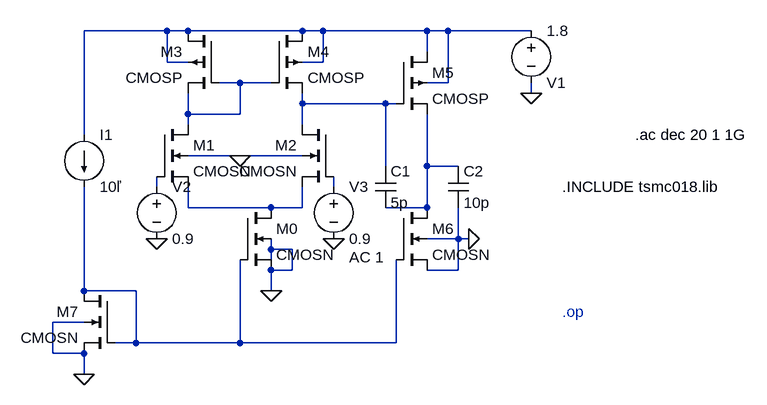
[diagram p0: schematic ac_response_design2.asc]
ac_response_design2.asc, the LTspice schematic file:
Version 4.1
SHEET 1 932 680
WIRE 32 16 -96 16
WIRE 64 16 32 16
WIRE 240 16 64 16
WIRE 272 16 240 16
WIRE 432 16 272 16
WIRE 464 16 432 16
WIRE 592 16 464 16
WIRE 432 48 432 16
WIRE 32 64 32 16
WIRE 64 64 32 64
WIRE 272 64 272 16
WIRE 272 64 240 64
WIRE 144 96 112 96
WIRE 192 96 144 96
WIRE 464 96 464 16
WIRE 464 96 432 96
WIRE 592 112 592 96
WIRE 240 128 240 112
WIRE 368 128 240 128
WIRE 384 128 368 128
WIRE 64 144 64 112
WIRE 144 144 144 96
WIRE 144 144 64 144
WIRE 64 160 64 144
WIRE 240 160 240 128
WIRE -96 176 -96 16
WIRE 144 208 64 208
WIRE 240 208 144 208
WIRE 368 224 368 128
WIRE 432 224 432 144
WIRE 480 224 432 224
WIRE 16 256 16 240
WIRE 288 256 288 240
WIRE 64 288 64 256
WIRE 192 288 64 288
WIRE 240 288 240 256
WIRE 240 288 192 288
WIRE 432 288 432 224
WIRE 432 288 368 288
WIRE 480 336 480 288
WIRE 480 336 432 336
WIRE 496 336 480 336
WIRE 192 352 192 336
WIRE 224 352 192 352
WIRE 192 368 192 352
WIRE 224 384 224 352
WIRE 224 384 192 384
WIRE 480 384 480 336
WIRE 480 384 432 384
WIRE -96 416 -96 256
WIRE -16 416 -96 416
WIRE 192 416 192 384
WIRE -96 464 -144 464
WIRE -16 496 -16 416
WIRE -16 496 -48 496
WIRE 144 496 144 368
WIRE 144 496 -16 496
WIRE 384 496 384 368
WIRE 384 496 144 496
WIRE -144 512 -144 464
WIRE -96 512 -144 512
WIRE -96 544 -96 512
FLAG 192 416 0
FLAG 144 208 0
FLAG -96 544 0
FLAG 592 112 0
FLAG 16 336 0
FLAG 288 336 0
FLAG 496 336 0
SYMBOL cmosn 16 160 R0
SYMATTR InstName M1
SYMATTR Value2 l=0.5u w=6u
SYMBOL cmosn 288 160 M0
SYMATTR InstName M2
SYMATTR Value2 l=0.5u w=6u
SYMBOL cmosn 144 288 R0
SYMATTR InstName M0
SYMATTR Value2 l=0.5u w=13u
SYMBOL cmosn 384 288 R0
SYMATTR InstName M6
SYMATTR Value2 l=0.5u w=59u
SYMBOL cmosp 112 16 M0
SYMATTR InstName M3
SYMATTR Value2 l=0.5u w=13u
SYMBOL cmosp 192 16 R0
SYMATTR InstName M4
SYMATTR Value2 l=0.5u w=13u
SYMBOL cmosp 384 48 R0
SYMATTR InstName M5
SYMATTR Value2 l=0.5u w=128u
SYMBOL voltage 592 0 R0
WINDOW 0 24 96 Left 2
WINDOW 3 24 16 Left 2
WINDOW 123 0 0 Left 0
WINDOW 39 0 0 Left 0
SYMATTR InstName V1
SYMATTR Value 1.8
SYMBOL cmosn -48 416 M0
SYMATTR InstName M7
SYMATTR Value2 l=0.5u w=1.1u
SYMBOL current -96 176 R0
WINDOW 123 0 0 Left 0
WINDOW 39 0 0 Left 0
SYMATTR InstName I1
SYMATTR Value 10ľ
SYMBOL voltage 16 240 R0
WINDOW 123 24 124 Left 2
WINDOW 39 0 0 Left 0
SYMATTR InstName V2
SYMATTR Value 0.9
SYMBOL voltage 288 240 R0
WINDOW 123 24 124 Left 2
WINDOW 39 0 0 Left 0
SYMATTR Value2 AC 1
SYMATTR InstName V3
SYMATTR Value 0.9
SYMBOL cap 352 224 R0
SYMATTR InstName C1
SYMATTR Value 5p
SYMBOL cap 464 224 R0
SYMATTR InstName C2
SYMATTR Value 10p
TEXT 640 256 Left 2 !.INCLUDE tsmc018.lib
TEXT 640 448 Left 2 ;.op
TEXT 752 176 Left 2 !.ac dec 20 1 1G

The netlist it stands for:
* ac_response_design2.asc
M1 N002 N005 N007 0 CMOSN l=0.5u w=6u
M2 N003 N006 N007 0 CMOSN l=0.5u w=6u
M0 N007 N008 0 0 CMOSN l=0.5u w=13u
M6 N004 N008 0 0 CMOSN l=0.5u w=59u
M3 N001 N002 N002 N001 CMOSP l=0.5u w=13u
M4 N001 N002 N003 N001 CMOSP l=0.5u w=13u
M5 N001 N003 N004 N001 CMOSP l=0.5u w=128u
V1 N001 0 1.8
M7 N008 N008 0 0 CMOSN l=0.5u w=1.1u
I1 N001 N008 10ľ
V2 N005 0 0.9
V3 N006 0 0.9 AC 1
C1 N003 N004 5p
C2 N004 0 10p
.model NMOS NMOS
.model PMOS PMOS
.lib standard.mos
.INCLUDE tsmc018.lib
* .op
.ac dec 20 1 1G
.backanno
.end